# Altium schematic sheet vlc_ctrl_T67.SchDoc
size Letter
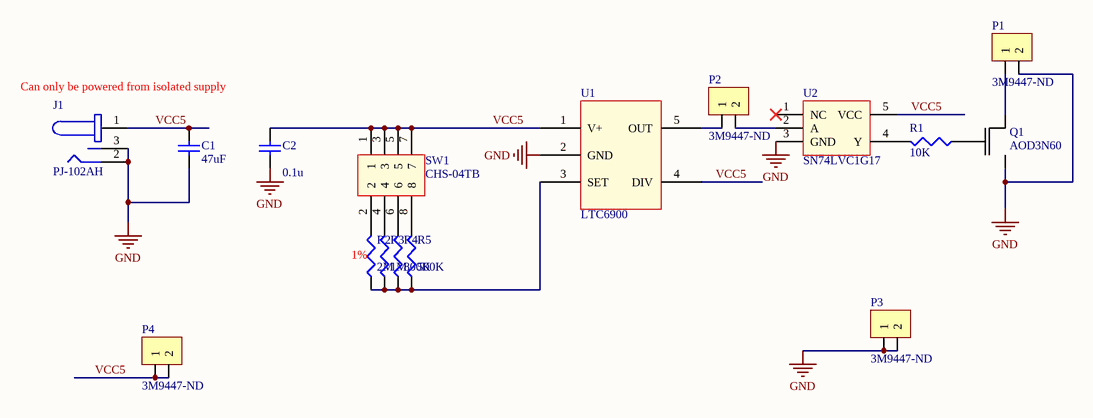
[diagram p0: vlc_ctrl_T67.SchDoc]

## Parts
C1  value 47uF  [C1210]  (hidden comment: Cap Semi)
C2  value 0.1u  [1608[0603]]  (hidden comment: Cap Semi)
J1  PJ-102AH  [PJ-102AH]
P1  Supplier Part Number 1: 3M9447-ND  [1x2 header]  (hidden comment: 1 x 2 header)
P2  Supplier Part Number 1: 3M9447-ND  [1x2 header]  (hidden comment: 1 x 2 header)
P3  Supplier Part Number 1: 3M9447-ND  [1x2 header]  (hidden comment: 1 x 2 header)
P4  Supplier Part Number 1: 3M9447-ND  [1x2 header]  (hidden comment: 1 x 2 header)
Q1  AOD3N60  [TO252]
R1  value 10K  [J1-0603]  (hidden comment: Res3)
R2  value 2M  [J1-0603]  (hidden comment: Res3)
R3  value 1M  [J1-0603]  (hidden comment: Res3)
R4  value 800K  [J1-0603]  (hidden comment: Res3)
R5  value 500K  [J1-0603]  (hidden comment: Res3)
SW1  CHS-04TB  [CHS04TB]
U1  LTC6900  [TSOT23]
U2  SN74LVC1G17  [SOT23-5]

## Nets
GND: C1.1 C2.1 J1.2 J1.3 P1.2 P3.1 P3.2 Q1.3(S) U1.2(GND) U2.3(GND)
VCC5: C1.2 C2.2 J1.1 P4.1 P4.2 SW1.1 SW1.3 SW1.5 SW1.7 U1.1(V+) U1.4(DIV) U2.5(VCC)
NetP1_1: P1.1 Q1.4(D)
NetP2_1: P2.1 U1.5(OUT)
NetP2_2: P2.2 U2.2(A)
NetQ1_1: Q1.1(G) R1.1
NetR1_2: R1.2 U2.4(Y)
NetR2_1: R2.1 R3.1 R4.1 R5.1 U1.3(SET)
NetR2_2: R2.2 SW1.2
NetR3_2: R3.2 SW1.4
NetR4_2: R4.2 SW1.6
NetR5_2: R5.2 SW1.8

Not connected (* = marked no-connect by the designer): U2 1(NC)*

## Notes on the sheet
- Can only be powered from isolated supply
- (near R2) 1%
- Title
- Date:
- Author:
- Revision:
- Sheet
- of
- University of Michigan
- File:

## Library data of the parts
C1 C2 = Cap Semi: Capacitor (Semiconductor SIM Model); Published: 8-Jun-2000; LatestRevisionDate: 29-May-2009; LatestRevisionNote: IPC-7351 Footprint Added.; PackageReference: C1206; Publisher: Altium Limited; PackageDescription: Chip Capacitor
J1 = PJ-102AH: CONN PWR JACK 2.1X5.5MM HIGH CUR; Supplier 1: Digi-Key; Supplier Part Number 1: CP-102AH-ND
P1-P4 = 1 x 2 header: 100 mils standard header; Supplier 1: Digi-Key
Q1 = AOD3N60: 600V,2.5A N-Channel MOSFET; Supplier 1: Digi-Key; Supplier Part Number 1: 785-1181-1-ND
R1-R5 = Res3: Resistor; Published: 8-Jun-2000; LatestRevisionDate: 29-May-2009; LatestRevisionNote: IPC-7351 Footprint Added.; PackageReference: J1-0603; Publisher: Altium Limited; PackageDescription: Chip Resistor
SW1 = CHS-04TB: SLIDE SWITCHES
U1 = LTC6900: Low Power, 1kHz to 20MHz   Resistor Set SOT-23 Oscillator; Supplier 1: Digi-Key; Supplier Part Number 1: LTC6900CS5#TRMCT-ND
U2 = SN74LVC1G17: SINGLE SCHMITT-TRIGGER BUFFER; Supplier 1: Digi-Key; Supplier Part Number 1: 296-11933-1-ND